# EasyEDA Pro project v1.2_PCB.epro

# Board v1.2_PCB
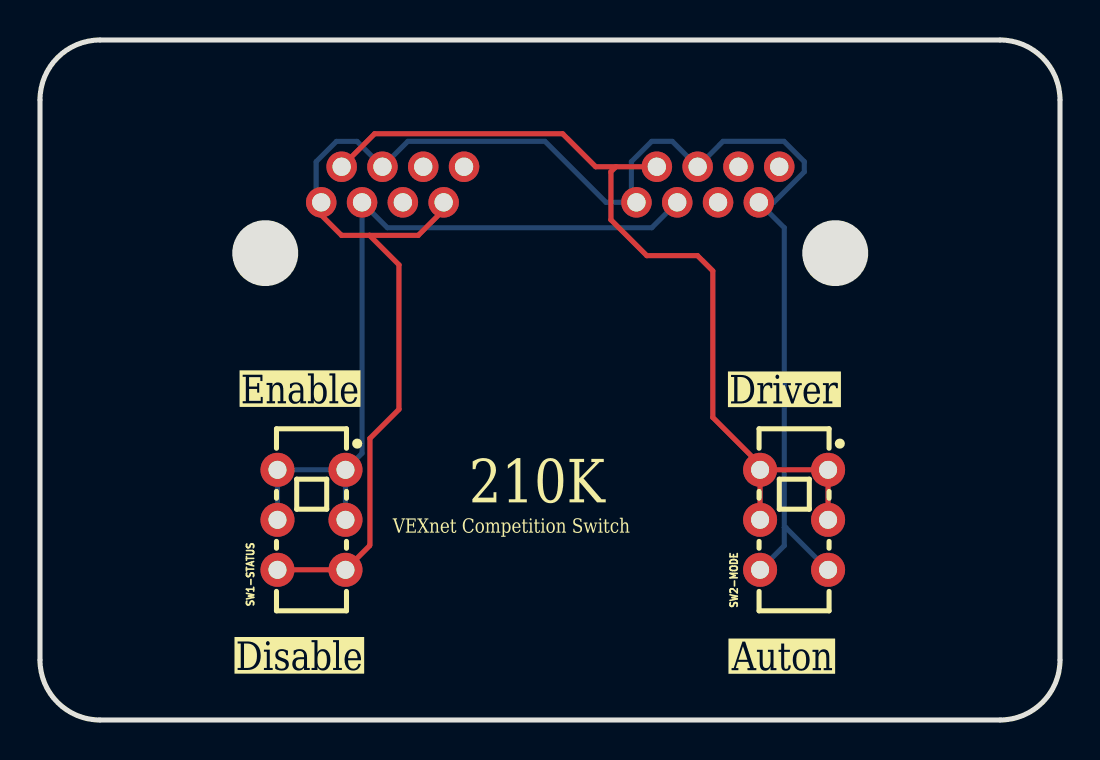
[diagram p0: board, top side]
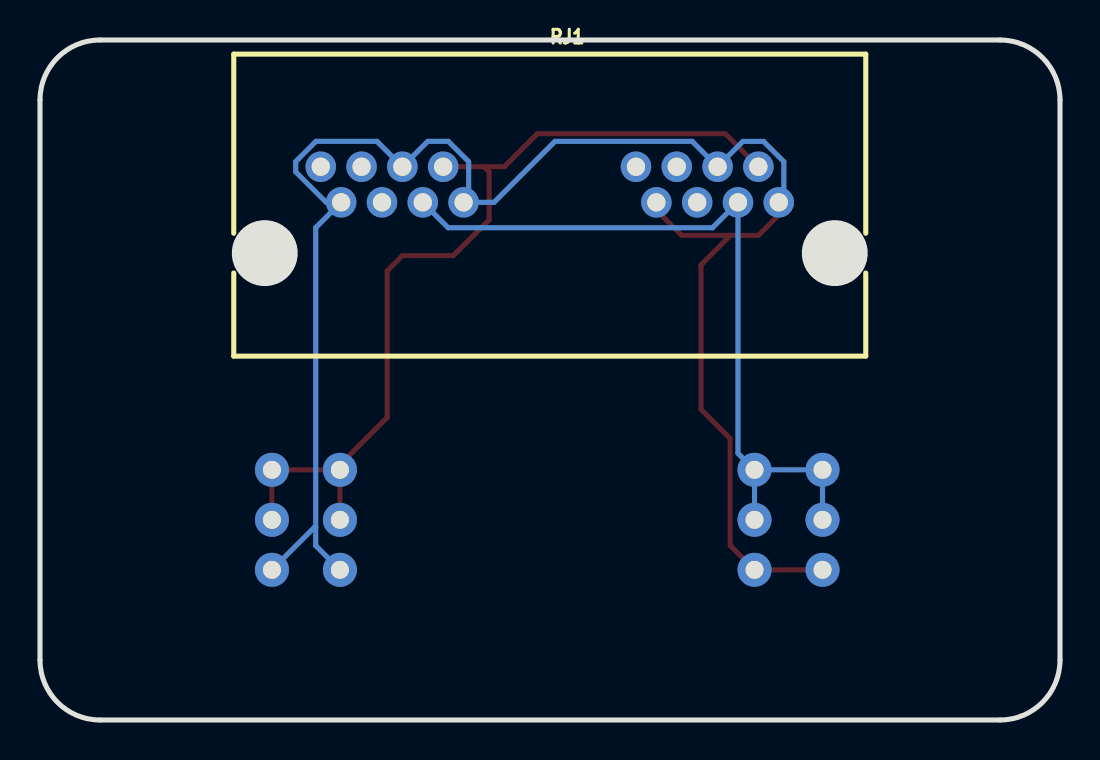
[diagram p1: board, bottom side, seen from below]

Outline 51 x 34 mm; copper layers: Top Layer, Bottom Layer. Coordinates in mm from the lower left corner of the outline.
Outline path: 0,31 arc(0.88,33.12) 3,34 48,34 arc(50.12,33.12) 51,31 51,3 arc(50.12,0.88) 48,0 3,0 arc(0.88,0.88) 0,3 0,31
Stack: Top Layer 0.035mm / Dielectric1 1.51mm FR4 er 4.5 / Bottom Layer 0.035mm

## Design rules (mm)
spacing Default (default): track to track 0.152, other pairs 0 to 0.152
track width Default (default): min 0.254, default 0.254, max 25.4
differential pair differentialPair (default): width min 0.127, default 0.254, max 2.54; gap min 0.152, default 0.152
via Default (default): diameter min 0.61, default 0.61, max 100.025; hole min 0.305, default 0.305, max 59.995

## Placement (name value [footprint] x y rotation side)
RJ1  HC-RJ45-5JA-2-6  [RJ45-TH_HC-RJ45-5JA-2-6-S]  25.51 26.77 180 bottom
SW1-STATUS  MSS22D18G2  [SW-TH_MSS22D18GX]  13.57 10.01 270 top
SW2-MODE  MSS22D18G2  [SW-TH_MSS22D18GX]  37.7 10.01 270 top

## Footprints (pads in the part's own frame, mm; a bottom-side part is the same pattern mirrored in y, then rotated)
RJ45-TH_HC-RJ45-5JA-2-6-S
  round 1.524 hole 0.914: 1(11.45,-0.89) 2(10.43,0.89) 3(9.41,-0.89) 4(8.39,0.89) 5(7.37,-0.89) 6(6.35,0.89) 7(5.33,-0.89) 8(4.31,0.89) 9(-4.31,-0.89) 10(-5.33,0.89) 11(-6.35,-0.89) 12(-7.37,0.89) 13(-8.39,-0.89) 14(-9.41,0.89) 15(-10.43,-0.89) 16(-11.45,0.89)
SW-TH_MSS22D18GX
  round 1.7 hole 0.9: 1(-2.5,1.7) 2(0,1.7) 3(2.5,1.7) 4(-2.5,-1.7) 5(0,-1.7) 6(2.5,-1.7)

## Nets
GND: RJ1.1 RJ1.4 RJ1.7 RJ1.9 RJ1.12 RJ1.15 SW1-STATUS.3 SW1-STATUS.6 SW2-MODE.3 SW2-MODE.6
RJ1_2: RJ1.2 RJ1.10 SW2-MODE.1 SW2-MODE.2 SW2-MODE.4 SW2-MODE.5
RJ1_3: RJ1.3 RJ1.11 SW1-STATUS.1 SW1-STATUS.2 SW1-STATUS.4 SW1-STATUS.5

Pads without a net: RJ1 5 6 8 13 14 16

## Routing (per net, layer and track width the routed paths; a pad name or vN(x,y) marks a point on that pad's centre or on a via; arc(x,y) is an arc through that point)
GND: length 89.3
  Top Layer w0.254: SW1-STATUS.6 SW1-STATUS.3 16.47,8.71 16.47,8.74 ; RJ1.7 20.18,25.5 18.91,24.23 16.47,24.23 ; 16.5,8.74 16.5,14.08 17.95,15.53 17.95,22.76 16.47,24.23 ; 16.47,24.23 15.08,24.23 14.06,25.25 RJ1.1
  Bottom Layer w0.254: 29.57,25.88 29.57,27.92 30.58,28.93 31.61,28.93 RJ1.12 34.15,28.93 37.2,28.93 38.22,27.92 38.22,27.41 36.69,25.88 35.94,25.88 ; RJ1.9 28.3,25.88 25.25,28.93 18.39,28.93 RJ1.4 15.85,28.93 14.82,28.93 13.81,27.91 13.81,26.14 RJ1.1 ; 35.94,25.88 37.21,24.61 37.21,9.63 ; 35.94,25.88 RJ1.15 ; 37.21,9.63 37.21,8.72 SW2-MODE.6 ; 37.21,9.63 37.28,9.63 SW2-MODE.3
RJ1_2: length 45.1
  Top Layer w0.254: 36,12.76 33.64,15.13 33.64,22.45 32.88,23.22 30.34,23.22 28.54,25.01 28.54,27.41 28.8,27.66 ; 28.8,27.66 RJ1.10 ; 28.8,27.66 27.78,27.66 26.13,29.31 16.73,29.31 RJ1.2 ; SW2-MODE.2 SW2-MODE.1 SW2-MODE.4 SW2-MODE.5
RJ1_3: length 38.9
  Bottom Layer w0.254: SW1-STATUS.1 SW1-STATUS.4 SW1-STATUS.5 ; SW1-STATUS.1 16.1,13.34 RJ1.3 17.37,24.61 30.59,24.61 RJ1.11 ; SW1-STATUS.1 SW1-STATUS.2

## Text on the board
Top Solder Mask Layer: @NoozAbooz | Made with ❤️ in Canada
Top Silkscreen Layer: VEXnet Competition Switch | 210K | Disable | Enable | Driver | Auton
